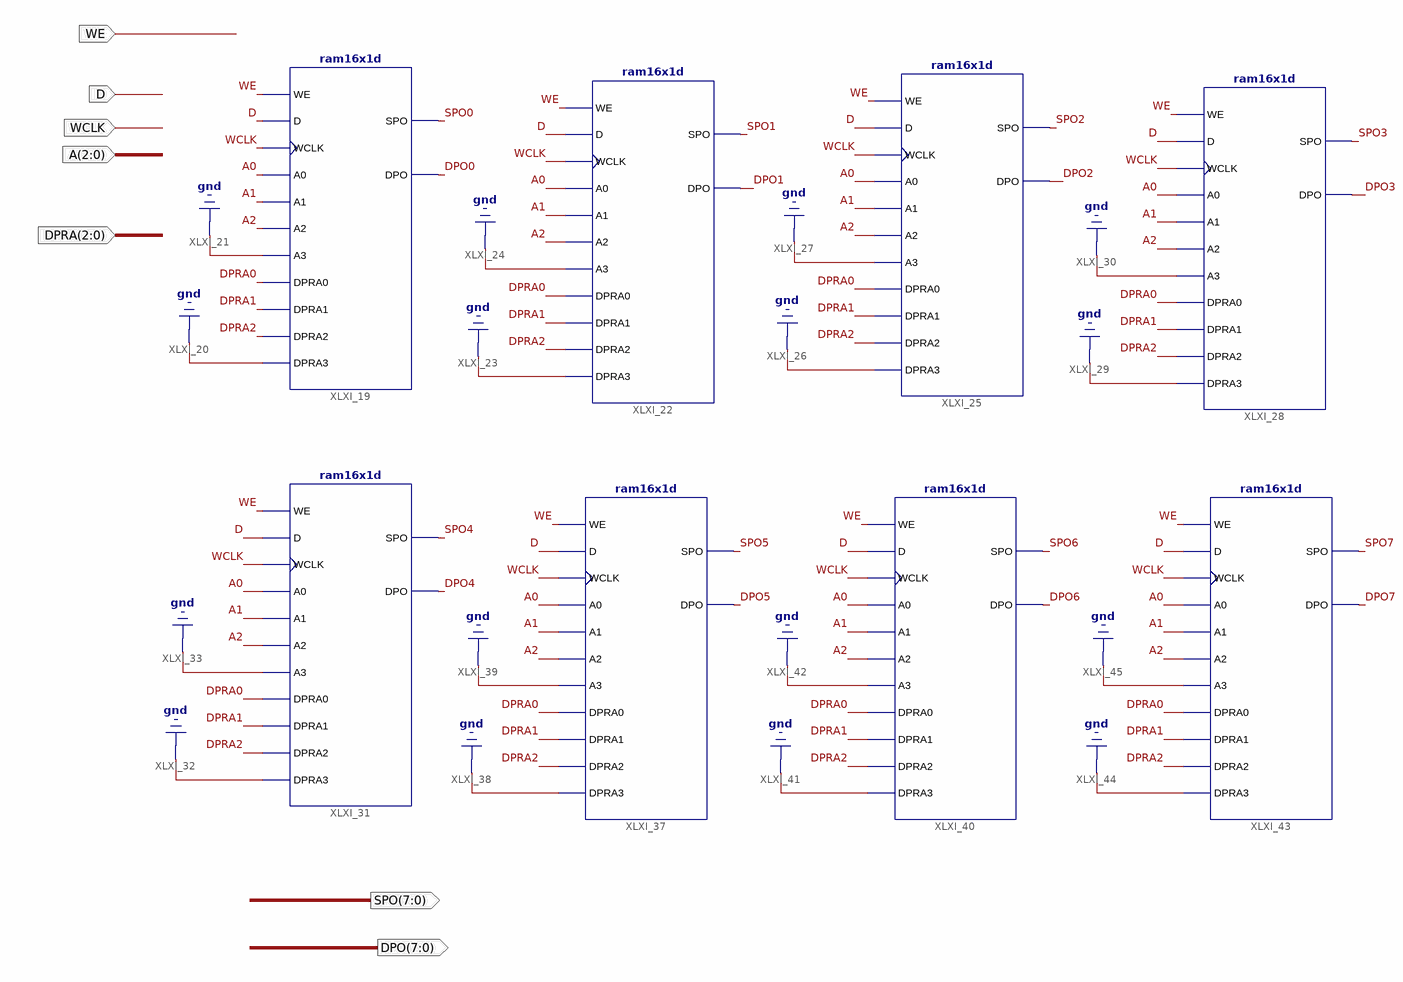
[diagram p0: schematic sheet 1]
// Xilinx ISE schematic RAM16X8D.sch (spartan6) as structural Verilog: 8 symbols, 7 ports
module RAM16X8D (
  input  WE,
  input  D,
  input  WCLK,
  input  [2:0] A,
  input  [2:0] DPRA,
  output [7:0] SPO,
  output [7:0] DPO
);

  wire A0, A1, A2, DPO0, DPO1, DPO2, DPO3, DPO4, DPO5, DPO6, DPO7, DPRA0, DPRA1, DPRA2, SPO0, SPO1, SPO2,
       SPO3, SPO4, SPO5, SPO6, SPO7;

  ram16x1d XLXI_19 (
    .A0(A0), .A1(A1), .A2(A2), .A3(1'b0), .D(D), .DPRA0(DPRA0), .DPRA1(DPRA1), .DPRA2(DPRA2), .DPRA3(1'b0),
    .WCLK(WCLK), .WE(WE), .DPO(DPO0), .SPO(SPO0));
  ram16x1d XLXI_22 (
    .A0(A0), .A1(A1), .A2(A2), .A3(1'b0), .D(D), .DPRA0(DPRA0), .DPRA1(DPRA1), .DPRA2(DPRA2), .DPRA3(1'b0),
    .WCLK(WCLK), .WE(WE), .DPO(DPO1), .SPO(SPO1));
  ram16x1d XLXI_25 (
    .A0(A0), .A1(A1), .A2(A2), .A3(1'b0), .D(D), .DPRA0(DPRA0), .DPRA1(DPRA1), .DPRA2(DPRA2), .DPRA3(1'b0),
    .WCLK(WCLK), .WE(WE), .DPO(DPO2), .SPO(SPO2));
  ram16x1d XLXI_28 (
    .A0(A0), .A1(A1), .A2(A2), .A3(1'b0), .D(D), .DPRA0(DPRA0), .DPRA1(DPRA1), .DPRA2(DPRA2), .DPRA3(1'b0),
    .WCLK(WCLK), .WE(WE), .DPO(DPO3), .SPO(SPO3));
  ram16x1d XLXI_31 (
    .A0(A0), .A1(A1), .A2(A2), .A3(1'b0), .D(D), .DPRA0(DPRA0), .DPRA1(DPRA1), .DPRA2(DPRA2), .DPRA3(1'b0),
    .WCLK(WCLK), .WE(WE), .DPO(DPO4), .SPO(SPO4));
  ram16x1d XLXI_37 (
    .A0(A0), .A1(A1), .A2(A2), .A3(1'b0), .D(D), .DPRA0(DPRA0), .DPRA1(DPRA1), .DPRA2(DPRA2), .DPRA3(1'b0),
    .WCLK(WCLK), .WE(WE), .DPO(DPO5), .SPO(SPO5));
  ram16x1d XLXI_40 (
    .A0(A0), .A1(A1), .A2(A2), .A3(1'b0), .D(D), .DPRA0(DPRA0), .DPRA1(DPRA1), .DPRA2(DPRA2), .DPRA3(1'b0),
    .WCLK(WCLK), .WE(WE), .DPO(DPO6), .SPO(SPO6));
  ram16x1d XLXI_43 (
    .A0(A0), .A1(A1), .A2(A2), .A3(1'b0), .D(D), .DPRA0(DPRA0), .DPRA1(DPRA1), .DPRA2(DPRA2), .DPRA3(1'b0),
    .WCLK(WCLK), .WE(WE), .DPO(DPO7), .SPO(SPO7));
endmodule
